# EAGLE design TBS_Analog_Front-End (EAGLE 9.7.0)
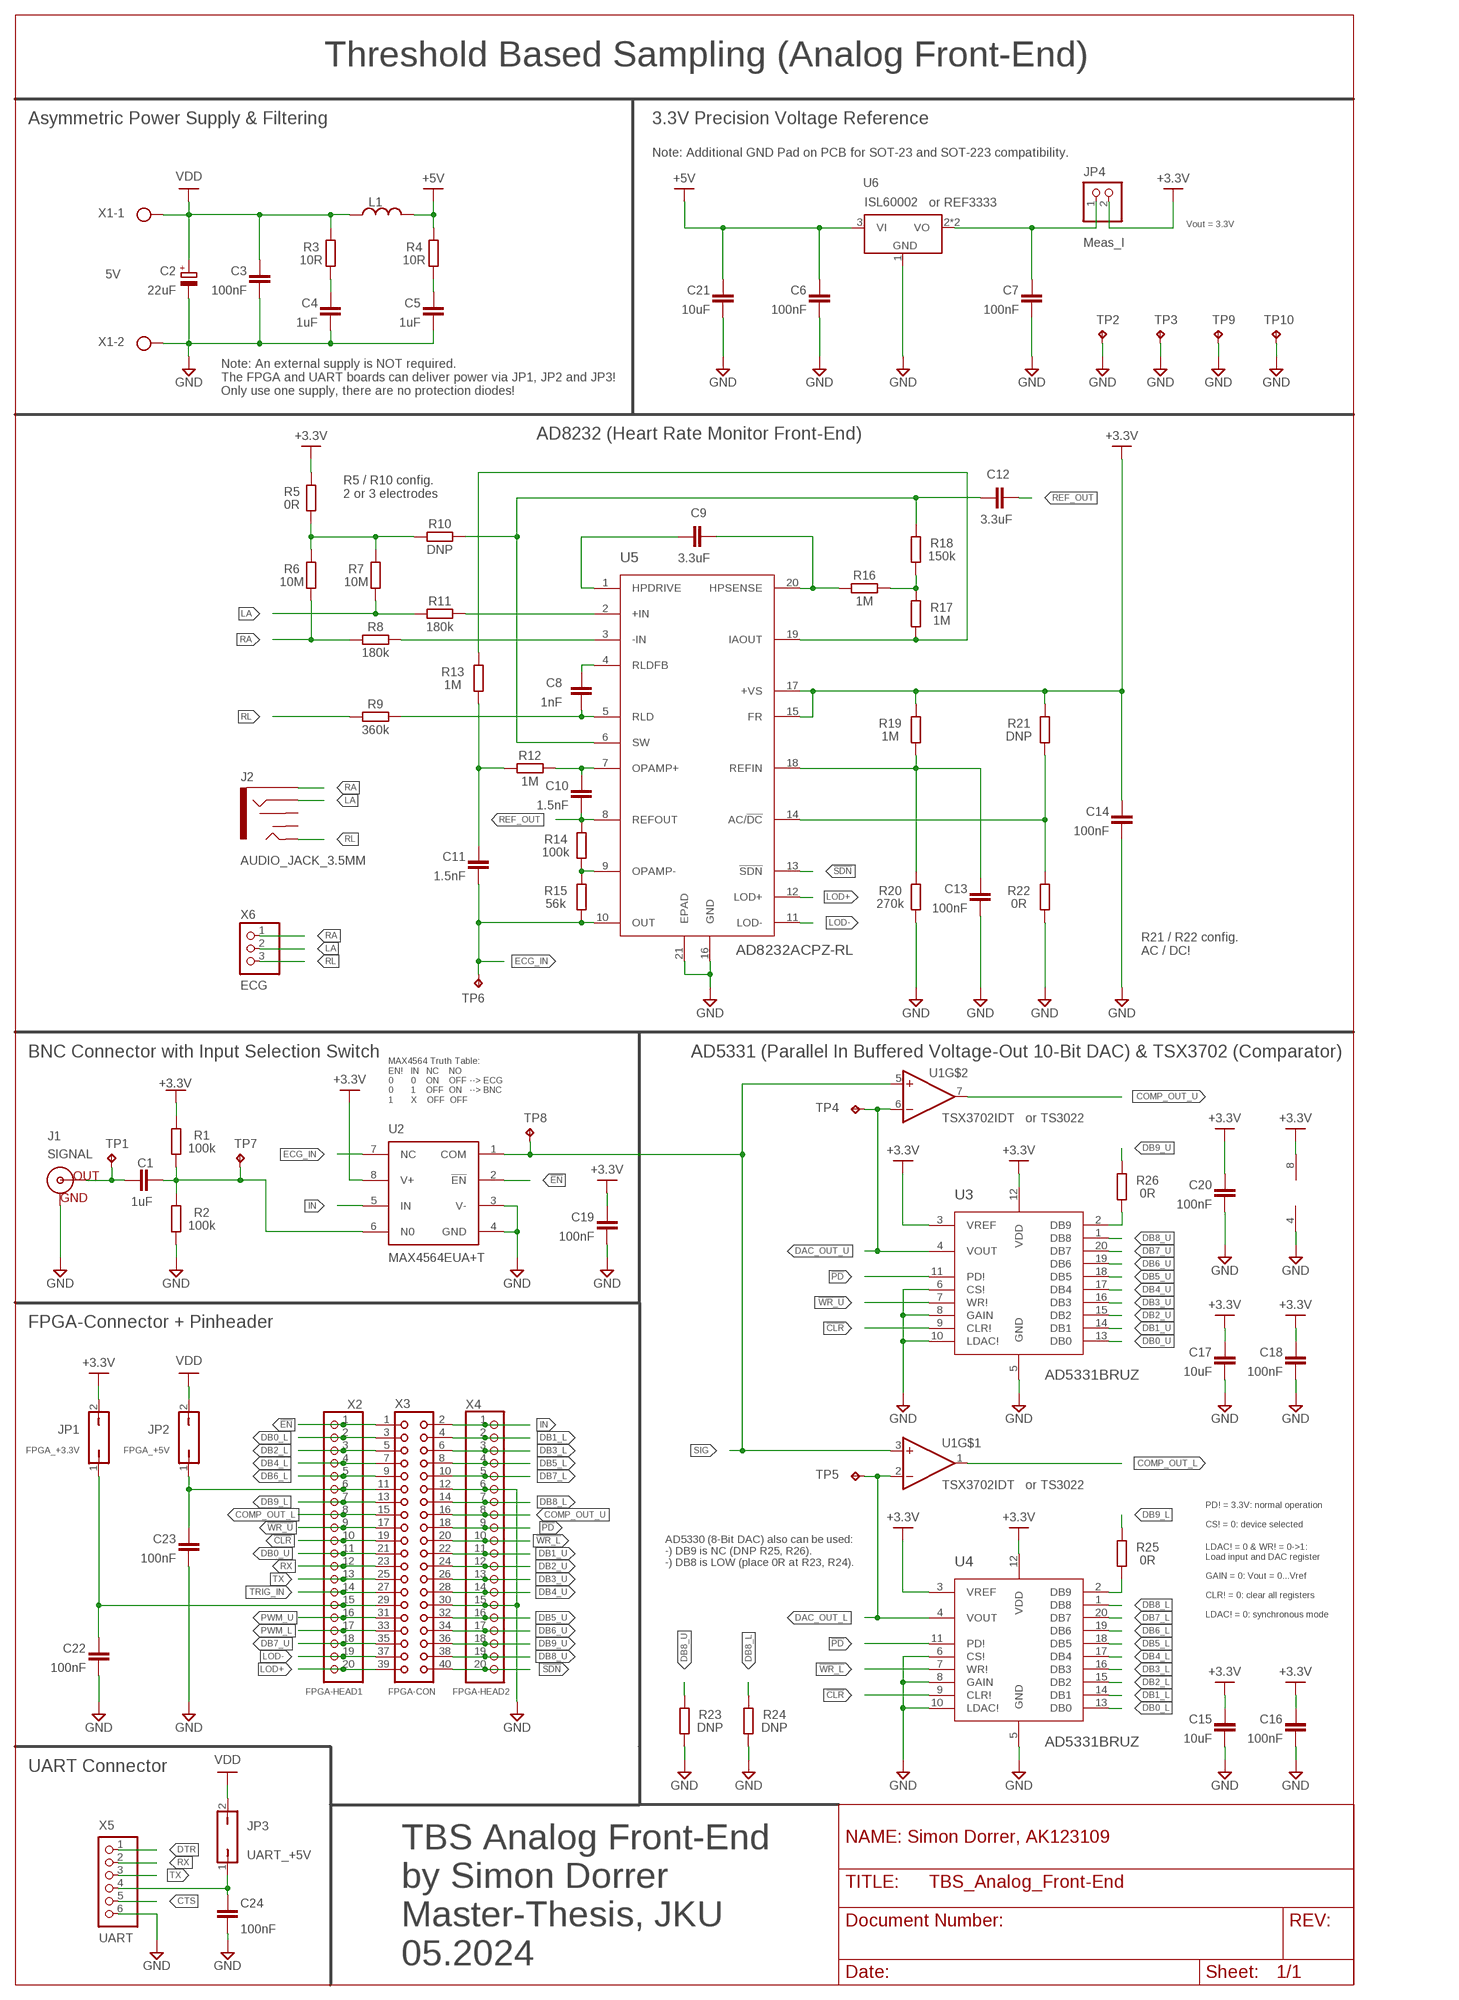
[diagram p0: schematic, sheet 1]

## Parts
C1  1uF  C_CHIP-0805(2012-METRIC)  [CAPC2012X110]
C2  22uF  CPOL-EUSMCD  [SMC_D]
C3  100nF  C_CHIP-0805(2012-METRIC)  [CAPC2012X110]
C4  1uF  C_CHIP-0805(2012-METRIC)  [CAPC2012X110]
C5  1uF  C_CHIP-0805(2012-METRIC)  [CAPC2012X110]
C6  100nF  C_CHIP-0805(2012-METRIC)  [CAPC2012X110]
C7  100nF  C_CHIP-0805(2012-METRIC)  [CAPC2012X110]
C8  1nF  C_CHIP-0805(2012-METRIC)  [CAPC2012X110]
C9  3.3uF  C_CHIP-0805(2012-METRIC)  [CAPC2012X110]
C10  1.5nF  C_CHIP-0805(2012-METRIC)  [CAPC2012X110]
C11  1.5nF  C_CHIP-0805(2012-METRIC)  [CAPC2012X110]
C12  3.3uF  C_CHIP-0805(2012-METRIC)  [CAPC2012X110]
C13  100nF  C_CHIP-0805(2012-METRIC)  [CAPC2012X110]
C14  100nF  C_CHIP-0805(2012-METRIC)  [CAPC2012X110]
C15  10uF  C_CHIP-0805(2012-METRIC)  [CAPC2012X110]
C16  100nF  C_CHIP-0805(2012-METRIC)  [CAPC2012X110]
C17  10uF  C_CHIP-0805(2012-METRIC)  [CAPC2012X110]
C18  100nF  C_CHIP-0805(2012-METRIC)  [CAPC2012X110]
C19  100nF  C_CHIP-0805(2012-METRIC)  [CAPC2012X110]
C20  100nF  C_CHIP-0805(2012-METRIC)  [CAPC2012X110]
C21  10uF  C_CHIP-0805(2012-METRIC)  [CAPC2012X110]
C22  100nF  C_CHIP-0805(2012-METRIC)  [CAPC2012X110]
C23  100nF  C_CHIP-0805(2012-METRIC)  [CAPC2012X110]
C24  100nF  C_CHIP-0805(2012-METRIC)  [CAPC2012X110]
J1  SIGNAL  BNCPTH  [BNC]
J2  AUDIO_JACK_3.5MM  AUDIO_JACK_3.5MM_SMD  [AUDIO-JACK-3.5MM-SMD]
JP1  FPGA_+3.3V  JP1Q  [JP1]
JP2  FPGA_+5V  JP1Q  [JP1]
JP3  UART_+5V  JP1Q  [JP1]
JP4  Meas_I  PINHD-1X2  [1X02]
L1  L_CHIP-1206(3216-METRIC)  [INDC3216X190]
R1  100k  R_CHIP-0805(2012-METRIC)  [RESC2012X65]
R2  100k  R_CHIP-0805(2012-METRIC)  [RESC2012X65]
R3  10R  R_CHIP-0805(2012-METRIC)  [RESC2012X65]
R4  10R  R_CHIP-0805(2012-METRIC)  [RESC2012X65]
R5  0R  R_CHIP-0805(2012-METRIC)  [RESC2012X65]
R6  10M  R_CHIP-0805(2012-METRIC)  [RESC2012X65]
R7  10M  R_CHIP-0805(2012-METRIC)  [RESC2012X65]
R8  180k  R_CHIP-0805(2012-METRIC)  [RESC2012X65]
R9  360k  R_CHIP-0805(2012-METRIC)  [RESC2012X65]
R10  DNP  R_CHIP-0805(2012-METRIC)  [RESC2012X65]
R11  180k  R_CHIP-0805(2012-METRIC)  [RESC2012X65]
R12  1M  R_CHIP-0805(2012-METRIC)  [RESC2012X65]
R13  1M  R_CHIP-0805(2012-METRIC)  [RESC2012X65]
R14  100k  R_CHIP-0805(2012-METRIC)  [RESC2012X65]
R15  56k  R_CHIP-0805(2012-METRIC)  [RESC2012X65]
R16  1M  R_CHIP-0805(2012-METRIC)  [RESC2012X65]
R17  1M  R_CHIP-0805(2012-METRIC)  [RESC2012X65]
R18  150k  R_CHIP-0805(2012-METRIC)  [RESC2012X65]
R19  1M  R_CHIP-0805(2012-METRIC)  [RESC2012X65]
R20  270k  R_CHIP-0805(2012-METRIC)  [RESC2012X65]
R21  DNP  R_CHIP-0805(2012-METRIC)  [RESC2012X65]
R22  0R  R_CHIP-0805(2012-METRIC)  [RESC2012X65]
R23  DNP  R_CHIP-0805(2012-METRIC)  [RESC2012X65]
R24  DNP  R_CHIP-0805(2012-METRIC)  [RESC2012X65]
R25  0R  R_CHIP-0805(2012-METRIC)  [RESC2012X65]
R26  0R  R_CHIP-0805(2012-METRIC)  [RESC2012X65]
TP1  TPPAD1-13  [P1-13]
TP2  TPPAD1-13  [P1-13]
TP3  TPPAD1-13  [P1-13]
TP4  TPPAD1-13  [P1-13]
TP5  TPPAD1-13  [P1-13]
TP6  TPPAD1-13  [P1-13]
TP7  TPPAD1-13  [P1-13]
TP8  TPPAD1-13  [P1-13]
TP9  TPPAD1-13  [P1-13]
TP10  TPTP20SQ  [TP20SQ]
U1  TSX3702IDT  [SOIC127P600X175-8N]
U2  MAX4564EUA+T  [UMAX-8]
U3  AD5331BRUZ  AD5331BRUZ_FUNCAD5331BRUZ  [AD5331BRUZ]
U4  AD5331BRUZ  AD5331BRUZ_FUNCAD5331BRUZ  [AD5331BRUZ]
U5  AD8232ACPZ-RL  AD8232ACPZ-RL_FUNCAD8232ACPZ-RL  [AD8232ACPZ-RL]
U6  ISL60002  LD1117_SOT223  [SOT230P700X170-4]
X1  5V  AK500/2  [AK500/2]
X2  FPGA-HEAD1  PINHD-1X20  [1X20]
X3  FPGA-CON  CON40  [CON40]
X4  FPGA-HEAD2  PINHD-1X20  [1X20]
X5  UART  PINHD-1X6  [1X06]
X6  ECG  PINHD-1X3  [1X03]

## Nets
!CLR: U3.9(CLR!) U4.9(CLR!) X2.10 X3.19
!EN: U2.2(!EN) X2.1 X3.1
!PD: U3.11(PD!) U4.11(PD!) X3.18 X4.9
!SDN: U5.13(!SDN) X3.40 X4.20
!WR_L: U4.7(WR!) X3.20 X4.10
!WR_U: U3.7(WR!) X2.9 X3.17
+3.3V: C14.2 C15.2 C16.2 C17.2 C18.2 C19.2 C20.2 JP1.2 JP4.2 R1.2 R5.1 R19.1 R21.1 U1.8(V+) U2.8(V+) U3.3(VREF) U3.12(VDD) U4.3(VREF) U4.12(VDD) U5.15(FR) U5.17(+VS)
+5V: C6.2 C21.2 L1.2 R4.2 U6.3(VI)
BNC_IN: C1.2 R1.1 R2.2 TP7.TP U2.6(N0)
COMP_OUT_L: U1.1(OUT) X2.8 X3.15
COMP_OUT_U: U1.7(OUT) X3.16 X4.8
CTS: X5.5
DAC_OUT_L: TP5.TP U1.2(-IN) U4.4(VOUT)
DAC_OUT_U: TP4.TP U1.6(-IN) U3.4(VOUT)
DB0_L: U4.13(DB0) X2.2 X3.3
DB0_U: U3.13(DB0) X2.11 X3.21
DB1_L: U4.14(DB1) X3.4 X4.2
DB1_U: U3.14(DB1) X3.22 X4.11
DB2_L: U4.15(DB2) X2.3 X3.5
DB2_U: U3.15(DB2) X3.24 X4.12
DB3_L: U4.16(DB3) X3.6 X4.3
DB3_U: U3.16(DB3) X3.26 X4.13
DB4_L: U4.17(DB4) X2.4 X3.7
DB4_U: U3.17(DB4) X3.28 X4.14
DB5_L: U4.18(DB5) X3.8 X4.4
DB5_U: U3.18(DB5) X3.32 X4.16
DB6_L: U4.19(DB6) X2.5 X3.9
DB6_U: U3.19(DB6) X3.34 X4.17
DB7_L: U4.20(DB7) X3.10 X4.5
DB7_U: U3.20(DB7) X2.18 X3.35
DB8_L: R24.2 U4.1(DB8) X3.14 X4.7
DB8_U: R23.2 U3.1(DB8) X3.38 X4.19
DB9_L: R25.2 X2.7 X3.13
DB9_U: R26.2 X3.36 X4.18
DTR: X5.1
ECG_IN: C11.1 R15.2 TP6.TP U2.7(NC) U5.10(OUT)
FPGA_+3.3V: C22.2 JP1.1 X2.15 X3.29
FPGA_+5V: C23.2 JP2.1 X2.6 X3.11
GND: C2.- C3.2 C4.2 C5.2 C6.1 C7.1 C13.1 C14.1 C15.1 C16.1 C17.1 C18.1 C19.1 C20.1 C21.1 C22.1 C23.1 C24.1 J1.GND R2.1 R20.2 R22.2 R23.1 R24.1 TP2.TP TP3.TP TP9.TP TP10.TP U1.4(V-) U2.3(V-) U2.4(GND) U3.5(GND) U3.6(CS!) U3.8(GAIN) U3.10(LDAC!) U4.5(GND) U4.6(CS!) U4.8(GAIN) U4.10(LDAC!) U5.16(GND) U5.21(EPAD) U6.1(GND) X1.2 X3.12 X3.30 X4.6 X4.15 X5.6
IN: U2.5(IN) X3.2 X4.1
LA: J2.RING R7.2 R11.2 X6.2
LOD+: U5.12(LOD+) X2.20 X3.39
LOD-: U5.11(LOD-) X2.19 X3.37
N$2: R25.1 U4.2(DB9)
N$4: C5.1 R4.1
N$5: C4.1 R3.1
N$6: R26.1 U3.2(DB9)
N$14: C24.2 JP3.1 X5.4
N$38: R11.1 U5.2(+IN)
N$39: R8.1 U5.3(-IN)
N$40: C8.2 U5.4(RLDFB)
N$41: C9.2 U5.1(HPDRIVE)
N$42: R5.2 R6.1 R7.1 R10.1
N$43: C12.2 R10.2 R18.2 U5.6(SW)
N$44: C8.1 R9.1 U5.5(RLD)
N$45: C9.1 R16.1 U5.20(HPSENSE)
N$46: C10.2 R12.1 U5.7(OPAMP+)
N$47: C11.2 R12.2 R13.2
N$48: R14.2 R15.1 U5.9(OPAMP-)
N$49: R21.2 R22.1 U5.14(AC/!DC)
N$50: C7.2 JP4.1 U6.2(VO) U6.4(VO)
N$51: R16.2 R17.2 R18.1
N$52: R13.1 R17.1 U5.19(IAOUT)
N$54: C13.2 R19.2 R20.1 U5.18(REFIN)
PWM_L: X2.17 X3.33
PWM_U: X2.16 X3.31
RA: J2.SLEEVE R6.2 R8.2 X6.1
REF_OUT: C10.1 C12.1 R14.1 U5.8(REFOUT)
RL: J2.TIP R9.2 X6.3
RX: X2.12 X3.23 X5.2
SIG: TP8.TP U1.3(+IN) U1.5(+IN) U2.1(COM)
SIGNAL: C1.1 J1.S(OUT) TP1.TP
TRIG_IN: X2.14 X3.27
TX: X2.13 X3.25 X5.3
VDD: C2.+ C3.1 JP2.2 JP3.2 L1.1 R3.2 X1.1
Unconnected: J2.RSH J2.TSH

## Notes on the sheet
- Threshold Based Sampling (Analog Front-End)
- Asymmetric Power Supply & Filtering | 3.3V Precision Voltage Reference
- Note: Additional GND Pad on PCB for SOT-23 and SOT-223 compatibility.
- or REF3333
- Vout = 3.3V
- Note: An external supply is NOT required.
  The FPGA and UART boards can deliver power via JP1, JP2 and JP3!
  Only use one supply, there are no protection diodes!
- AD8232 (Heart Rate Monitor Front-End)
- R5 / R10 config.
  2 or 3 electrodes
- R21 / R22 config.
  AC / DC!
- BNC Connector with Input Selection Switch | AD5331 (Parallel In Buffered Voltage-Out 10-Bit DAC) & TSX3702 (Comparator)
- MAX4564 Truth Table:
  EN!   IN   NC    NO
  0       0    ON    OFF --> ECG
  0       1    OFF  ON   --> BNC
  1       X    OFF  OFF
- or TS3022
- FPGA-Connector + Pinheader
- or TS3022
- PD! = 3.3V: normal operation
- CS! = 0: device selected
- LDAC! = 0 & WR! = 0->1:
  Load input and DAC register
- AD5330 (8-Bit DAC) also can be used: 
  -) DB9 is NC (DNP R25, R26). 
  -) DB8 is LOW (place 0R at R23, R24).
- GAIN = 0: Vout = 0...Vref
- CLR! = 0: clear all registers
- LDAC! = 0: synchronous mode
- UART Connector
- NAME: Simon Dorrer, AK123109
- TBS Analog Front-End
  by Simon Dorrer
  Master-Thesis, JKU
  05.2024

## Library data of the parts
C1 C3-C24 = Capacitor:C: Capacitor - Generic; CATEGORY: Capacitor
C2 = rcl:CPOL-EU: POLARIZED CAPACITOR, European symbol; SPICEPREFIX: C
J1 = SparkFun-Connectors:BNC: BNC Right Angle Connector Mouser Part# 5227161 SparkFun Products: BNC Connector - Right Angle <https://www.sparkfun.com/products/10550>; PROD_ID: LPA-12729; SF_ID: PRT-10550
J2 = SparkFun-Connectors:AUDIO_JACK_3.5MM: Audio Jack 3.5mm variants of PTH and SMT stereo audio jack with bypass switches. SparkFun Products: SparkFun SparkPunk Sound Kit <[https://www.sparkfun.com/products/11177]> - PTH MP3 Trigger <https://www.sparkfun.com/products/13720> -3.5mm SMD SparkFun PicoBoard <https://www.sparkfun.com/products/11888>- 2.5mm SMD; PROD_ID: CONN-10353
JP1-JP3 = jumper:JP1Q: JUMPER
JP4 = Connector:PINHD-1X2: PIN HEADER; CATEGORY: Headers; DESCRIPTION: Header, Straight, 2 Position; MANUFACTURER: Generic; MPN: Generic; OPERATING_TEMPERATURE: Generic; PART_STATUS: Active; PITCH: 0.100" (2.54mm); ROHS_COMPLIANCE: Generic; SERIES: Generic; SUB-CATEGORY: Headers, Male Pins; TYPE: Board to Board or Cable, Unshrouded, Through Hole, Straight
L1 = Inductor:L: Inductor Fixed - Generic; CATEGORY: Inductor; SUB-CATEGORY: Fixed
R1-R26 = Resistor:R: Resistor Fixed - Generic; CATEGORY: Resistor; SUB-CATEGORY: Fixed
TP1-TP10 = testpad:TP: Test pad
U1 = TSX3702IDT:TSX3702IDT
U2 = MAX4564:MAX4564EUA+T
U3 U4 = AD5331BRUZ:AD5331BRUZ_FUNC; COPYRIGHT: Copyright (C) 2024 Ultra Librarian. All rights reserved.; MANUFACTURER_PART_NUMBER: AD5331BRUZ; MFR_NAME: Analog Devices Inc
U5 = AD8232ACPZ-RL:AD8232ACPZ-RL_FUNC; COPYRIGHT: Copyright (C) 2024 Ultra Librarian. All rights reserved.; MANUFACTURER_PART_NUMBER: AD8232ACPZ-RL; MFR_NAME: Analog Devices Inc
U6 = LM1117:LD1117: Adjustable and fixed positive voltage regulator Reference Datasheet <https://www.st.com/content/ccc/resource/technical/document/datasheet/99/3b/7d/91/91/51/4b/be/CD00000544.pdf/files/CD00000544.pdf/jcr:content/translations/en.CD00000544.pdf>; CATEGORY: IC_Linear; DESCRIPTION: Adjustable voltage regulator; MANUFACTURER: STMicroelectronics; MPN: Generic; SERIES: LM1117; SUB-CATEGORY: Voltage Regulator; TYPE: Linear
X1 = con-ptr500:AK500/2: CONNECTOR; OC_FARNELL: unknown; OC_NEWARK: unknown
X2 X4 = pinhead:PINHD-1X20: PIN HEADER
X3 = con-harting_modulated:CON40: CONNECTOR; OC_FARNELL: unknown; OC_NEWARK: unknown
X5 = pinhead:PINHD-1X6: PIN HEADER
X6 = Connector:PINHD-1X3: PIN HEADER; CATEGORY: Headers; DESCRIPTION: Header, Straight, 3 Position; MANUFACTURER: Generic; MPN: Generic; OPERATING_TEMPERATURE: Generic; PART_STATUS: Active; PITCH: 0.100" (2.54mm); ROHS_COMPLIANCE: Generic; SERIES: Generic; SUB-CATEGORY: Headers, Male Pins; TYPE: Board to Board or Cable, Unshrouded, Through Hole, Straight

## Board
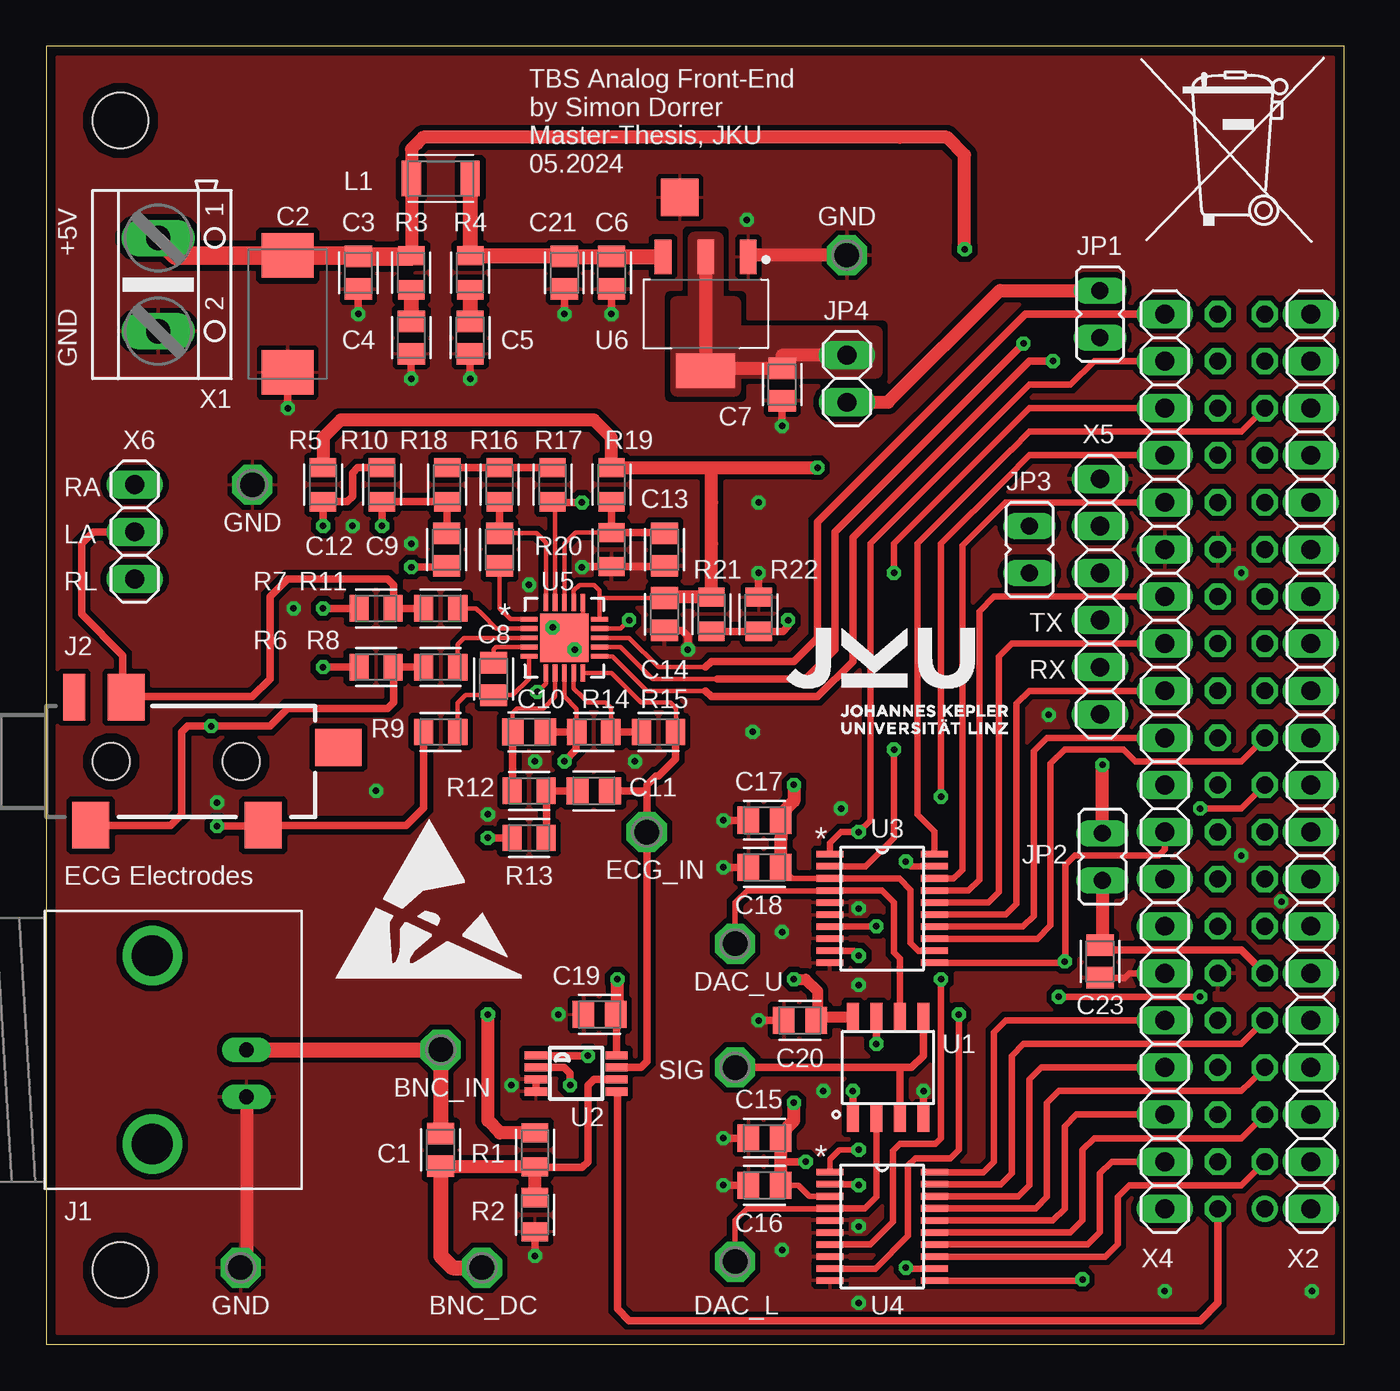
[diagram p1: board, top side]
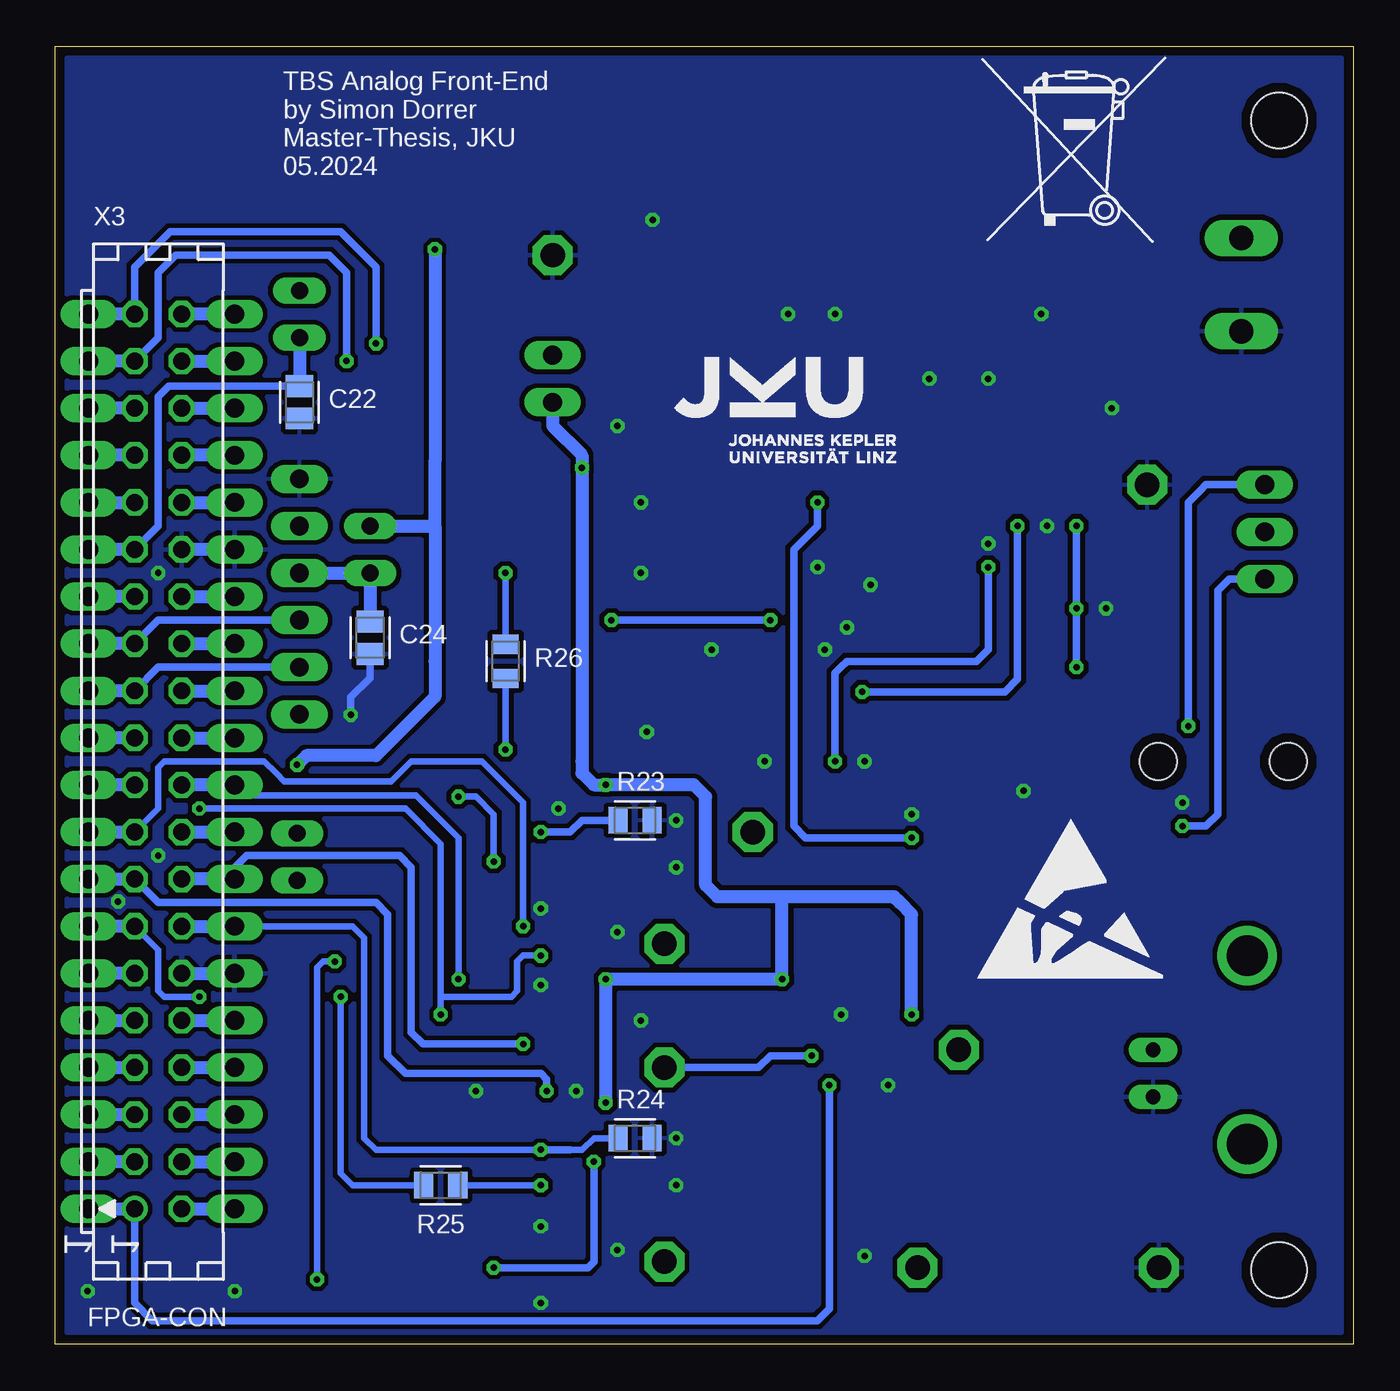
[diagram p2: board, bottom side, seen from below]

Size 70 x 70 mm. Coordinates in mm from the lower left corner, seen from the top.
Outline: 0,0 70,0 70,70 0,70 0,0
Copper layers (1*16): Top / Bottom
Stack-up Default Layer Stack: Top User Defined 0.035mm / Dielectric-1 User Defined 1.5mm / Bottom User Defined 0.035mm
Design rules: minimum copper width all 0.2mm, minimum copper width 0.2mm, minimum drill size all 0.35mm, minimum drill size 0.35mm, copper clearance wire_polygon to wire_polygon 0.2mm, copper clearance wire_polygon to pad_smd 0.2mm, copper clearance wire_polygon to via 0.2mm, copper clearance pad_smd to pad_smd 0.2mm, copper clearance pad_smd to via 0.2mm, copper clearance via to via 0.2mm, copper clearance smd to pad (same net) 0.2mm, copper clearance smd to via (same net) 0.2mm, copper clearance smd to smd (same net) 0.2mm, dimension clearance all to all 10mil, dimension clearance 0.2mm, via restrict clearance 0mil, restrict clearance 0mil, drill distance 6mil, keepout clearance 0mil
Holes 3 mm at 4,66 4,4

### Footprints (pad centres in the part's own frame; a part is rotated, then mirrored left to right if it is on the bottom)
CAPC2012X110 = smd 1.165 x 1.465: 1 -0.875,0; 2 0.875,0
SMC_D = smd 2.4 x 2.8: + -3.15,0; - 3.15,0
BNC = drill 2.2: 3 -5.08,5.08; 4 5.08,5.08 | drill 0.8 long: GND -2.54,0; S 0,0
AUDIO-JACK-3.5MM-SMD = smd 2 x 2.5: RING 4.3,3.45; SLEEVE 2.4,-3.45; TIP 11.7,-3.45 | smd 1.2 x 2.5: RSH 1.5,3.45 | smd 2.5 x 2: TSH 15.75,0.75 | hole 2: 3.5,0; 10.5,0
JP1 = drill 0.914 long: 1 0,-1.27; 2 0,1.27
1X02 = drill 1.016 long: 1 -1.27,0; 2 1.27,0
INDC3216X190 = smd 1.043 x 1.91: 1 -1.584,0; 2 1.584,0
RESC2012X65 = smd 1.031 x 1.42: 1 -0.919,0; 2 0.919,0
P1-13 = drill 1.321 pad 2.159 octagon: TP 0,0
TP20SQ = smd 2 x 2: TP 0,0
SOIC127P600X175-8N = smd 1.525 x 0.65: 1 -2.712,1.905; 2 -2.712,0.635; 3 -2.712,-0.635; 4 -2.712,-1.905; 5 2.712,-1.905; 6 2.712,-0.635; 7 2.712,0.635; 8 2.712,1.905
UMAX-8 = smd 0.45 x 1.2: 1 -0.975,-2.175; 2 -0.325,-2.175; 3 0.325,-2.175; 4 0.975,-2.175; 5 0.975,2.175; 6 0.325,2.175; 7 -0.325,2.175; 8 -0.975,2.175
AD5331BRUZ = smd 1.462 x 0.355: 1 -2.819,2.925; 2 -2.819,2.275; 3 -2.819,1.625; 4 -2.819,0.975; 5 -2.819,0.325; 6 -2.819,-0.325; 7 -2.819,-0.975; 8 -2.819,-1.625; 9 -2.819,-2.275; 10 -2.819,-2.925; 11 2.819,-2.925; 12 2.819,-2.275; 13 2.819,-1.625; 14 2.819,-0.975; 15 2.819,-0.325; 16 2.819,0.325; 17 2.819,0.975; 18 2.819,1.625; 19 2.819,2.275; 20 2.819,2.925
AD8232ACPZ-RL = smd 0.9 x 0.25: 1 -1.9,1; 2 -1.9,0.5; 3 -1.9,0; 4 -1.9,-0.5; 5 -1.9,-1; 11 1.9,-1; 12 1.9,-0.5; 13 1.9,0; 14 1.9,0.5; 15 1.9,1 | smd 0.25 x 0.9: 6 -1,-1.9; 7 -0.5,-1.9; 8 0,-1.9; 9 0.5,-1.9; 10 1,-1.9; 16 1,1.9; 17 0.5,1.9; 18 0,1.9; 19 -0.5,1.9; 20 -1,1.9 | smd 2.6 x 2.6: 21 0,0
SOT230P700X170-4 = smd 1.86 x 0.898: 1 -3.075,2.3; 2 -3.075,0; 3 -3.075,-2.3 | smd 1.86 x 3.189: 4 3.075,0
AK500/2 = drill 1.321 long: 1 -2.515,0; 2 2.515,0
1X20 = drill 1.016 long: 1 -24.13,0; 2 -21.59,0; 3 -19.05,0; 4 -16.51,0; 5 -13.97,0; 6 -11.43,0; 7 -8.89,0; 8 -6.35,0; 9 -3.81,0; 10 -1.27,0; 11 1.27,0; 12 3.81,0; 13 6.35,0; 14 8.89,0; 15 11.43,0; 16 13.97,0; 17 16.51,0; 18 19.05,0; 19 21.59,0; 20 24.13,0
CON40 = drill 0.914: 1 -24.13,-1.27 | drill 0.914 octagon: 2 -24.13,1.27; 3 -21.59,-1.27; 4 -21.59,1.27; 5 -19.05,-1.27; 6 -19.05,1.27; 7 -16.51,-1.27; 8 -16.51,1.27; 9 -13.97,-1.27; 10 -13.97,1.27; 11 -11.43,-1.27; 12 -11.43,1.27; 13 -8.89,-1.27; 14 -8.89,1.27; 15 -6.35,-1.27; 16 -6.35,1.27; 17 -3.81,-1.27; 18 -3.81,1.27; 19 -1.27,-1.27; 20 -1.27,1.27; 21 1.27,-1.27; 22 1.27,1.27; 23 3.81,-1.27; 24 3.81,1.27; 25 6.35,-1.27; 26 6.35,1.27; 27 8.89,-1.27; 28 8.89,1.27; 29 11.43,-1.27; 30 11.43,1.27; 31 13.97,-1.27; 32 13.97,1.27; 33 16.51,-1.27; 34 16.51,1.27; 35 19.05,-1.27; 36 19.05,1.27; 37 21.59,-1.27; 38 21.59,1.27; 39 24.13,-1.27; 40 24.13,1.27
1X06 = drill 1.016 long: 1 -6.35,0; 2 -3.81,0; 3 -1.27,0; 4 1.27,0; 5 3.81,0; 6 6.35,0
1X03 = drill 1.016 long: 1 -2.54,0; 2 0,0; 3 2.54,0

### Placement (x,y rotation side)
C1  21.27,10.48 270 top
C2  13.02,55.56 270 top
C3  16.83,57.78 270 top
C4  19.68,54.29 270 top
C5  22.86,54.29 270 top
C6  30.48,57.78 90 top
C7  39.69,51.75 90 top
C8  24.13,35.88 90 top
C9  24.45,42.86 270 top
C10  26.04,33.02 180 top
C11  29.53,29.84 180 top
C12  21.59,42.86 90 top
C13  33.34,42.86 90 top
C14  33.34,39.37 90 top
C15  38.73,11.11 0 top
C16  38.73,8.57 0 top
C17  38.73,28.26 0 top
C18  38.73,25.72 0 top
C19  29.84,17.78 0 top
C20  40.64,17.46 0 top
C21  27.94,57.78 90 top
C22  56.83,50.8 90 bottom
C23  56.83,20.64 90 top
C24  53.02,38.1 90 bottom
J1  10.79,15.88 90 top
J2  0,31.43 0 top
JP1  56.83,55.56 0 top
JP2  56.96,26.29 0 top
JP3  53.02,42.86 0 top
JP4  43.18,52.07 270 top
L1  21.27,62.87 0 top
R1  26.35,10.48 90 top
R2  26.35,6.99 90 top
R3  19.68,57.78 90 top
R4  22.86,57.78 90 top
R5  14.92,46.35 270 top
R6  17.78,36.51 0 top
R7  17.78,39.69 0 top
R8  21.27,36.51 180 top
R9  21.27,33.02 180 top
R10  18.1,46.35 270 top
R11  21.27,39.69 180 top
R12  26.04,29.84 0 top
R13  26.04,27.3 0 top
R14  29.53,33.02 0 top
R15  33.02,33.02 0 top
R16  24.45,46.35 90 top
R17  27.3,46.35 90 top
R18  21.62,46.35 270 top
R19  30.48,46.35 270 top
R20  30.48,42.86 270 top
R21  35.88,39.37 270 top
R22  38.42,39.37 90 top
R23  38.73,28.26 180 bottom
R24  38.73,11.11 180 bottom
R25  49.21,8.57 180 bottom
R26  45.72,36.83 90 bottom
TP1  21.27,15.88 0 top
TP2  43.18,58.74 0 top
TP3  10.48,4.13 0 top
TP4  37.15,21.59 0 top
TP5  37.15,4.45 0 top
TP6  32.38,27.62 0 top
TP7  23.5,4.13 0 top
TP8  37.15,14.92 0 top
TP9  11.11,46.35 0 top
TP10  34.16,61.85 0 top
U1  45.4,14.92 90 top
U2  28.57,14.61 270 top
U3  45.09,23.5 0 top
U4  45.09,6.35 0 top
U5  27.94,38.1 0 top
U6  35.56,55.57 270 top
U$1  [MUELLTONNE_10.00]  58.42,59.05 0 top
U$2  [ESD_10.00]  15.56,19.68 0 top
U$3  [MUELLTONNE_10.00]  20.64,59.05 0 bottom
U$4  [ESD_10.00]  20.32,19.68 0 bottom
X1  6.03,57.15 270 top
X2  68.2,31.43 90 top
X3  64.45,31.43 90 top
X4  60.33,31.43 90 top
X5  56.83,40.32 90 top
X6  4.76,43.81 270 top

### Tracks (layer width: path | path; a pad name or v marks a point on that pad's centre or on a via)
!CLR  (via drill 0.35)
  Top 0.35: U3.9 43.55,21.22 v43.81,20.95 | v49.21,17.78 49.21,10.48 48.77,10.03 46.86,10.03 46.48,9.65 46.48,5.84 44.72,4.08 U4.9 | v62.23,28.89 64.45,28.89 X3.19
  Bottom 0.35: v43.81,20.95 44.77,20.95 45.09,20.64 45.09,19.05 45.4,18.73 49.21,18.73 | v62.23,28.89 61.59,28.89 56.52,28.89 51.12,28.89 49.21,26.99 49.21,22.54 49.21,20 49.21,18.73 | 49.21,18.73 v49.21,17.78
  Bottom 0.7: X3.19 X2.10
!EN  (via drill 0.35)
  Top 0.4: U2.2 27.93,14.93 28.26,14.61 v28.26,13.97
  Bottom 0.4: v28.26,13.97 28.26,1.91 28.89,1.27 64.77,1.27 65.72,2.22 X3.1
  Bottom 0.7: X2.1 X3.1
!PD  (via drill 0.35)
  Top 0.35: U3.11 54.23,20.57 54.54,20.57 | X4.9 60.33,26.67 60.01,26.35 55.47,26.35 54.97,25.85 54.97,21.95 54.97,20.57 54.54,20.57 | U4.11 55.81,3.42 v55.88,3.49 | 54.54,20.57 54.86,20.57 v54.93,20.64
  Bottom 0.35: v55.88,3.49 55.88,16.83 55.88,20.32 55.56,20.64 v54.93,20.64
  Bottom 0.7: X3.18 X4.9
!SDN
  Top 0.25: U5.13 31.43,38.1 33.02,36.51 35.56,36.51
  Top 0.4: 35.56,36.51 35.88,36.83 40.32,36.83 41.59,38.1 41.59,44.35 52.81,55.56 54.29,55.56 X4.20
  Bottom 0.7: X4.20 X3.40
!WR_L  (via drill 0.35)
  Top 0.35: v48.26,19.68 48.26,13.34 48.26,11.11 47.94,10.79 46.04,10.79 45.66,10.41 45.66,6.6 44.45,5.4 44.43,5.38 U4.7
  Bottom 0.35: v48.26,19.68 48.26,22.54 48.26,23.5 48.26,27.3 50.55,29.59 54.36,29.59 59.75,29.59 X4.10
  Bottom 0.7: X4.10 X3.20
!WR_U  (via drill 0.35)
  Top 0.35: v44.77,22.54 44.74,22.52 U3.7
  Bottom 0.35: v44.77,22.54 44.77,29.21 45.72,30.16 46.99,31.43 50.8,31.43 51.88,30.35 57.66,30.35 58.1,30.8 58.74,31.43 64.14,31.43 64.45,31.11 64.45,30.16 64.45,28.89 X3.17
  Bottom 0.7: X2.9 X3.17
+3.3V  (via drill 0.35)
  Top 0.25: C14.2 30.4,40.24 29.92,40.24 29.84,40.32 | U5.15 29.84,39.68 29.84,39.69 29.84,40.32 | U5.17 28.44,40.64 28.76,40.96 29.53,40.96 29.84,40.64 29.84,40.32
  Top 0.3: U3.3 40.21,25.12 C18.2 | U4.3 41.16,7.97 40.56,8.57 C16.2
  Top 0.35: U4.12 46.41,4.08 v46.35,4.13 | U3.12 47.04,21.22 46.61,21.65 46.61,23.11 46.61,24.51 46.04,25.08 46,25.12 U3.3
  Top 0.4: C19.2 30.75,17.75 U2.8 | 39.61,9.84 v40.96,9.84
  Top 0.6: U1.8 41.69,17.63 C20.2 41.59,17.54 41.59,19.05 40.96,19.68 v40.32,19.68
  Top 0.7: v30.8,19.68 30.8,17.86 C19.2 | C14.2 33.38,40.29 R21.1 35.88,43.18 35.88,45.4 35.88,47.27 | R5.1 14.92,48.9 15.88,49.85 16.19,49.85 29.53,49.85 30.48,48.9 R19.1 35.88,47.27 | R1.2 24.45,11.4 24.45,11.43 23.81,12.06 23.81,16.51 v23.81,17.78 | 35.88,47.27 v41.59,47.27 | JP4.2 45.4,50.8 51.44,56.83 JP1.2 | C16.2 39.61,9.84 C15.2 39.61,11.35 40.32,12.06 v40.32,13.02 | C18.2 39.61,27.28 39.63,27.3 39.63,28.24 C17.2 39.61,28.57 40.32,29.29 v40.32,30.16
  Bottom 0.4: v46.35,4.13 41.27,4.13 40.96,4.45 v40.96,9.84
  Bottom 0.7: 30.8,24.13 v30.8,19.68 36.83,19.68 v40.32,19.68 40.32,13.65 v40.32,13.02 | v23.81,17.78 23.81,23.18 24.45,23.81 24.77,24.13 30.8,24.13 | 30.8,24.13 34.29,24.13 34.92,24.77 34.92,29.53 35.56,30.16 v40.32,30.16 40.96,30.16 41.59,30.8 41.59,31.43 v41.59,47.27 41.59,47.94 43.18,49.53 JP4.2
+5V
  Top 0.8: U6.3 33.25,58.66 C6.2 C21.2 27.9,58.7 R4.2 L1.2
BNC_IN
  Top 0.4: U2.6 29.53,14.29 29.21,13.97 29.21,13.65 29.21,9.84 28.89,9.53 27.94,9.53 26.39,9.53 R1.1
  Top 0.7: 21.32,9.56 C1.2 21.32,9.56 | R1.1 21.32,9.56 | R2.2 26.35,9.49 26.39,9.53
  Top 0.8: 21.32,9.56 C1.2 21.27,4.76 21.91,4.13 TP7.TP
COMP_OUT_L  (via drill 0.35)
  Top 0.4: U1.1 v43.5,13.65
  Bottom 0.4: X3.15 64.45,23.81 58.74,23.81 53.98,23.81 52.7,23.81 52.07,23.18 52.07,15.56 51.12,14.61 48.26,14.61 43.81,14.61 43.5,14.29 v43.5,13.65
  Bottom 0.7: X2.8 X3.15
COMP_OUT_U  (via drill 0.35)
  Top 0.4: U1.7 v44.77,16.19
  Bottom 0.4: v44.77,16.19 46.67,16.19 50.16,16.19 50.8,16.83 50.8,17.14 50.8,25.72 51.44,26.35 59.69,26.35 60.33,25.72 X4.8
  Bottom 0.7: X4.8 X3.16
DAC_OUT_L
  Top 0.3: U4.4 42.24,7.3 37.78,7.3 37.15,6.67 TP5.TP
  Top 0.35: U4.4 44.16,7.33 44.77,7.94 U1.2
DAC_OUT_U
  Top 0.3: U3.4 42.24,24.45 37.78,24.45 37.15,23.81 TP4.TP
  Top 0.35: U3.4 45.06,24.47 45.72,23.81 45.72,21.13 46.04,20.81 U1.6
DB0_L
  Top 0.35: U4.13 57.11,4.72 57.78,5.4 57.78,7.94 58.42,8.57 64.45,8.57 X3.3
  Bottom 0.7: X3.3 X2.2
DB0_U
  Top 0.35: X3.21 64.45,31.43 58.74,31.43 58.1,32.07 54.93,32.07 54.17,31.31 54.17,30.67 54.17,22.59 53.45,21.87 U3.13
  Bottom 0.7: X3.21 X2.11
DB1_L
  Top 0.35: U4.14 53,5.38 56.17,5.38 56.83,6.03 56.83,9.21 57.47,9.84 X4.2
  Bottom 0.7: X3.4 X4.2
DB1_U
  Top 0.35: U3.14 52.68,22.52 53.26,23.09 53.26,31.98 53.98,32.7 X4.11
  Bottom 0.7: X3.22 X4.11
DB2_L
  Top 0.35: X3.5 64.77,11.43 64.45,11.11 58.74,11.11 56.52,11.11 55.88,10.48 55.88,6.67 55.24,6.03 U4.15
  Bottom 0.7: X2.3 X3.5
DB2_U
  Top 0.35: X4.12 53.02,35.24 52.32,34.54 52.32,23.75 51.74,23.17 U3.15
  Bottom 0.7: X3.24 X4.12
DB3_L
  Top 0.35: X4.3 58.74,12.38 55.56,12.38 54.93,11.75 54.93,7.3 54.3,6.67 U4.16
  Bottom 0.7: X3.6 X4.3
DB3_U
  Top 0.35: U3.16 50.81,23.82 51.37,24.38 51.37,37.08 52.07,37.78 X4.13
  Bottom 0.7: X3.26 X4.13
DB4_L
  Top 0.35: U4.17 52.41,7.33 53.36,7.33 53.98,7.94 53.98,13.02 54.61,13.65 58.74,13.65 64.45,13.65 64.95,14.15 X3.7
  Bottom 0.7: X2.4 X3.7
DB4_U
  Top 0.35: U3.17 49.74,24.47 50.32,25.05 50.32,39.53 51.12,40.32 55.24,40.32 58.42,40.32 X4.14
  Bottom 0.7: X3.28 X4.14
DB5_L
  Top 0.35: U4.18 50.84,7.97 51.79,7.97 52.42,7.97 53.02,8.57 53.02,14.29 53.66,14.92 58.74,14.92 X4.4
  Bottom 0.7: X3.8 X4.4
DB5_U
  Top 0.35: X4.16 52.07,45.4 51.73,45.4 49.4,43.08 49.4,25.59 49.21,25.4 48.93,25.12 U3.18
  Bottom 0.7: X3.32 X4.16
DB6_L
  Top 0.35: U4.19 49.9,8.62 51.12,8.62 51.17,8.62 51.49,8.62 52.07,9.21 52.07,15.56 52.7,16.19 58.74,16.19 64.45,16.19 64.77,16.51 X3.9
  Bottom 0.7: X2.5 X3.9
DB6_U  (via drill 0.35)
  Top 0.35: U3.19 46.62,25.77 v46.35,26.04 | X4.17 53.02,47.94 51.75,46.67 48.26,43.18 48.26,33.66 v48.26,29.53
  Bottom 0.35: v48.26,29.53 47.31,29.53 46.35,28.57 v46.35,26.04
  Bottom 0.7: X4.17 X3.34
DB7_L
  Top 0.35: U4.20 48.96,9.28 50.55,9.28 51.12,9.84 51.12,16.83 51.75,17.46 58.74,17.46 X4.5
  Bottom 0.7: X3.10 X4.5
DB7_U
  Top 0.35: U3.20 47.9,27.66 46.99,28.57 46.99,43.18 52,48.19 52.07,48.26 53.02,49.21 53.66,49.21 64.45,49.21 X3.35
  Bottom 0.7: X3.35 X2.18
DB8_L  (via drill 0.35)
  Top 0.3: v43.81,10.48 42.79,10.48 42.27,9.96 U4.1
  Bottom 0.35: v43.81,10.48 49.53,10.48 52.71,10.48 53.34,11.11 53.34,13.97 53.34,18.73 53.34,20.64 53.34,21.91 53.98,22.54 54.61,22.54 X4.7 | 42.23,10.48 41.59,10.48 40.96,11.11 R24.2
  Bottom 0.4: v43.81,10.48 42.23,10.48
  Bottom 0.7: X3.14 X4.7
DB8_U  (via drill 0.35)
  Top 0.35: X4.19 56.52,53.02 55.24,51.75 53.02,51.75 44.45,43.18 44.45,28.26 v43.81,27.62 42.86,27.62 42.27,27.03 U3.1
  Bottom 0.4: v43.81,27.62 42.23,27.62 41.59,28.26 R23.2
  Bottom 0.7: X3.38 X4.19
DB9_L  (via drill 0.35)
  Top 0.35: v62.23,18.73 v54.61,18.73
  Bottom 0.35: X3.13 64.45,21.27 64.45,19.05 64.14,18.73 63.82,18.73 v62.23,18.73 | v54.61,18.73 54.61,18.1 54.61,15.56 54.61,9.21 53.98,8.57 R25.2
  Bottom 0.7: X3.13 X2.7
DB9_U  (via drill 0.35)
  Top 0.35: X4.18 53.02,50.48 45.72,43.18 v45.72,41.59
  Bottom 0.35: v45.72,41.59 R26.2
  Bottom 0.7: X3.36 X4.18
ECG_IN
  Top 0.25: R15.2 33.97,33.05 33.97,34.29 33.66,34.61 33.34,34.61 32.07,34.61 31.75,34.92 30.48,36.2 U5.10
  Top 0.4: 32.38,29.84 C11.1 | U2.7 31.75,14.92 32.07,14.92 32.38,15.24 32.38,25.72 TP6.TP 32.38,29.84 | 32.38,29.84 32.38,30.16 32.88,30.65 33.02,30.65 33.94,31.57 R15.2
FPGA_+3.3V
  Bottom 0.4: C22.2 63.9,51.67 64.45,51.12 64.45,44.13 X3.29
  Bottom 0.7: X3.29 X2.15 | JP1.1 C22.2
FPGA_+5V
  Top 0.4: X3.11 64.45,21.27 62.23,21.27 57.07,21.27 C23.2
  Top 0.7: JP2.1 56.96,21.64 C23.2
  Bottom 0.7: X3.11 X2.6
GND  (via drill 0.35)
  Top 0.25: U5.21 28.94,39.1 U5.16
  Top 0.35: U5.21 28.49,37.55 v28.49,37.47 | C23.1 58.18,19.76 58.42,20 X4.6
  Top 0.4: C5.2 v22.86,52.07 | C3.2 v16.83,55.56 | C2.- v13.02,50.48 | v27.94,55.56 C21.1 | v30.48,55.56 C6.1 | C7.1 v39.69,49.53 | v38.42,41.59 R22.2 | C14.1 34.29,38.49 34.61,38.18 v34.61,37.47 | R20.2 32.07,41.94 | 32.07,41.94 28.89,41.94 v28.89,41.91 | 32.07,41.94 33.29,41.94 C13.1 | C17.1 v36.51,28.26 | v36.51,25.72 C18.1 | C20.1 v38.42,17.46 | v36.51,11.11 C15.1 | v36.51,8.57 C16.1 | v47.31,13.65 U1.4 | U2.3 U2.4 | R2.1 v26.35,4.76 | v19.68,52.07 C4.2 | 56.75,19.68 C23.1
  Top 0.7: J1.GND 10.79,4.45 TP3.TP | TP2.TP 37.95,58.74 U6.1
  Bottom 0.4: v54.06,33.95 54.06,34.9 53.02,35.94 C24.1
  Bottom 0.7: X3.12 X4.6 | X4.15 X3.30
  other vias: 60.33,2.86 43.81,23.5 43.81,6.35 27.62,17.78 25.08,13.97 27.3,38.65 43.81,2.22 43.81,19.37 16.51,44.13 19.68,43.18 26.35,31.43 23.81,28.57 26.04,40.96 37.78,60.64 31.75,31.43 17.78,29.84 39.69,5.08 68.26,2.86 64.45,41.59 38.1,33.02 38.42,45.4 13.34,39.69 42.86,28.89 41.91,13.65 39.69,22.23 9.21,29.21 64.45,26.35 66.61,23.88
  pour Top (isolate 0.3, rank 2): 70,70 0,70 0,0 70,0
  pour Bottom (isolate 0.254, rank 2): 70,70 0,70 0,0 70,0
IN
  Top 0.4: U2.5 30.8,13.58 30.8,1.91 31.43,1.27 33.66,1.27 62.23,1.27 63.18,2.22 X3.2
  Bottom 0.7: X3.2 X4.1
LA
  Top 0.4: R11.2 R7.2 18.73,39.72 18.73,40.96 18.41,41.27 13.02,41.27 12.06,40.32 12.06,35.88 11.11,34.92 4.34,34.92 J2.RING 4.13,35.05 4.13,37.15 1.91,39.37 1.91,43.18 2.54,43.81 X6.2
LOD+  (via drill 0.35)
  Top 0.25: U5.12 30.98,37.6 31.75,36.83 32.7,35.88 36.2,35.88
  Top 0.4: 36.2,35.88 40.96,35.88 42.55,37.47 42.55,43.81 50.48,51.75 v52.7,53.98
  Bottom 0.4: X3.39 65.72,58.1 63.82,60.01 63.18,60.01 54.61,60.01 53.66,59.05 52.7,58.1 v52.7,53.98
  Bottom 0.7: X3.39 X2.20
LOD-  (via drill 0.35)
  Top 0.25: U5.11 30.53,37.1 31.43,36.2 32.38,35.24 35.56,35.24
  Top 0.4: 35.56,35.24 35.88,34.92 41.59,34.92 43.5,36.83 43.5,43.5 51.75,51.75 53.02,53.02 v54.29,53.02
  Bottom 0.4: X3.37 64.45,54.29 64.45,57.78 63.5,58.74 55.24,58.74 54.29,57.78 v54.29,53.02
  Bottom 0.7: X3.37 X2.19
N$2  (via drill 0.35)
  Top 0.35: U4.2 43.76,8.62 v43.81,8.57
  Bottom 0.35: v43.81,8.57 47.31,8.57 R25.1
N$4
  Top 0.8: R4.1 C5.1
N$5
  Top 0.8: R3.1 C4.1
N$6  (via drill 0.35)
  Top 0.35: U3.2 44.19,25.77 44.45,26.04 45.72,27.3 v45.72,32.07
  Bottom 0.35: v45.72,32.07 R26.1
N$14
  Bottom 0.7: C24.2 JP3.1 X5.4
N$38
  Top 0.25: U5.2 24.27,38.6 23.5,39.37 23.18,39.69 R11.1
N$39
  Top 0.25: U5.3 22.86,38.1 22.54,38.1 22.23,37.78 22.19,37.75 R8.1
N$40
  Top 0.25: U5.4 24.27,37.6 24.13,37.47 C8.2
N$41
  Top 0.25: U5.1 25.04,39.1 24.45,39.69 C9.2
N$42  (via drill 0.35)
  Top 0.4: R10.1 16.79,47.27 16.51,46.99 16.51,45.72 16.23,45.44 R5.2 v14.92,44.13 | R6.1 v14.92,36.51 | R7.1 v14.92,39.69
  Bottom 0.4: v14.92,36.51 v14.92,39.69 v14.92,44.13
N$43  (via drill 0.35)
  Top 0.25: U5.6 26.94,35.64 v26.48,35.18
  Top 0.4: C12.2 21.62,43.77 R18.2 R10.2 v18.1,44.13
  Bottom 0.4: v26.48,35.18 18.8,35.18 18.1,35.88 v18.1,44.13
N$44
  Top 0.25: U5.5 26.04,35.88 25.16,35 C8.1 22.62,35 22.54,34.92 22.19,34.58 R9.1
N$45
  Top 0.25: C9.1 26.43,43.74 26.94,43.23 U5.20
  Top 0.4: R16.1 C9.1
N$46
  Top 0.25: C10.2 25.16,34.05 25.4,34.29 26.8,34.29 27.44,34.92 U5.7
  Top 0.4: C10.2 25.16,29.89 R12.1
N$47
  Top 0.4: R12.2 26.99,29.84 | 26.99,29.84 C11.2 | R13.2 26.99,27.34 26.99,29.84
N$48
  Top 0.25: U5.9 28.44,35.38 28.89,34.92 29.21,34.61 30.16,34.61 30.45,34.32 R14.2
  Top 0.4: R14.2 R15.1
N$49  (via drill 0.35)
  Top 0.25: U5.14 30.98,38.6 v31.43,39.05
  Top 0.4: R21.2 R22.1 39.72,38.45 40.01,38.73 v40.01,39.05
  Bottom 0.4: v40.01,39.05 v31.43,39.05
N$50
  Top 0.7: U6.4 35.69,52.63 C7.2 39.69,53.34 JP4.1 | U6.4 35.75,52.31 U6.4 | U6.2 U6.4
  pour Top (no thermals): 34.61,60.01 34.61,56.52 33.66,56.52 33.66,51.12 37.47,51.12 37.47,52.07 45.09,52.07 45.09,54.93 37.47,54.93 37.47,56.52 36.51,56.52 36.51,60.01
N$51
  Top 0.4: R18.1 R16.2 R17.2
N$52  (via drill 0.35)
  Top 0.25: R17.1 27.44,45.59 27.44,45.4 27.44,43.5 U5.19
  Top 0.4: R13.1 v23.81,27.3 | v28.89,45.4 27.44,45.4
  Bottom 0.4: v23.81,27.3 29.53,27.3 30.16,27.94 30.16,42.86 28.89,44.13 v28.89,45.4
N$54
  Top 0.25: U5.18 27.94,43.18 28.54,43.78 R20.1
  Top 0.4: R19.2 R20.1 33.29,43.78 C13.2
PWM_L
  Bottom 0.7: X3.33 X2.17
PWM_U
  Bottom 0.7: X2.16 X3.31
RA  (via drill 0.35)
  Top 0.4: R8.2 18.73,36.51 | 18.73,36.51 R6.2 | J2.SLEEVE 6.71,27.98 7.3,28.57 7.3,33.02 7.62,33.34 8.57,33.34 | 8.57,33.34 v8.89,33.34 | v8.89,33.34 11.75,33.34 12.06,33.34 13.02,34.29 18.41,34.29 18.73,34.61 18.73,36.51 | v8.89,33.34 8.57,33.34
  Bottom 0.4: X6.1 7.94,46.35 8.26,46.04 8.89,45.4 v8.89,33.34
REF_OUT  (via drill 0.35)
  Top 0.25: U5.8 27.94,34.92 28.57,34.29 28.61,34.26 R14.1
  Top 0.4: C10.1 27.94,33.02 R14.1 28.57,32.99 28.57,32.07 v27.94,31.43 | C12.1 21.51,41.91 v19.68,41.91
  Bottom 0.4: v27.94,31.43 U5.8 27.62,36.51 27.3,36.83 20.32,36.83 19.68,37.47 v19.68,41.91
RL  (via drill 0.35)
  Top 0.4: R9.2 20.35,28.93 19.68,28.26 19.41,27.98 J2.TIP 11.66,27.94 v9.21,27.94
  Bottom 0.4: X6.3 6.67,41.27 7.3,40.64 7.3,28.57 7.94,27.94 v9.21,27.94
RX
  Bottom 0.4: X5.2 64.45,36.51 X3.23
  Bottom 0.7: X3.23 X2.12
SIG  (via drill 0.35)
  Top 0.4: U2.1 26.42,15.56 v29.21,15.56 | TP8.TP 46.04,14.92 | 46.04,14.92 46.67,14.92 47.31,15.56 U1.5 | U1.3 46.04,14.92
  Bottom 0.4: v29.21,15.56 30.8,15.56 31.43,15.56 32.07,14.92 TP8.TP
SIGNAL
  Top 0.8: J1.S TP1.TP C1.1
TRIG_IN
  Bottom 0.7: X3.27 X2.14
TX
  Bottom 0.4: X5.3 64.45,39.05 64.77,38.73 X3.25
  Bottom 0.7: X3.25 X2.13
VDD  (via drill 0.35)
  Top 0.7: v49.53,59.05 49.53,64.14 48.58,65.09 46.04,65.09 20.32,65.09 20,64.77 19.68,64.45 19.69,64.45 L1.1 R3.2 | JP2.2 v56.96,31.24
  Top 1: X1.1 6.99,58.71 C2.+ 16.77,58.71 C3.1 19.64,58.66 R3.2
  Bottom 0.7: 49.53,44.13 49.53,36.83 49.53,34.92 52.7,31.75 56.45,31.75 v56.96,31.24 | 49.53,44.13 49.53,47.62 v49.53,59.05 | JP3.2 49.53,44.13

### Text on the board
tNames: TBS Analog Front-End / by Simon Dorrer / Master-Thesis, JKU / 05.2024 | +5V | GND | GND | RA | GND | LA | RL | TX | RX | ECG Electrodes | ECG_IN | DAC_U | SIG | BNC_IN | GND | BNC_DC | DAC_L
bNames: TBS Analog Front-End / by Simon Dorrer / Master-Thesis, JKU / 05.2024 | FPGA-CON